# EAGLE design rooftop_reflector_v1.2 (EAGLE 9.6.2)
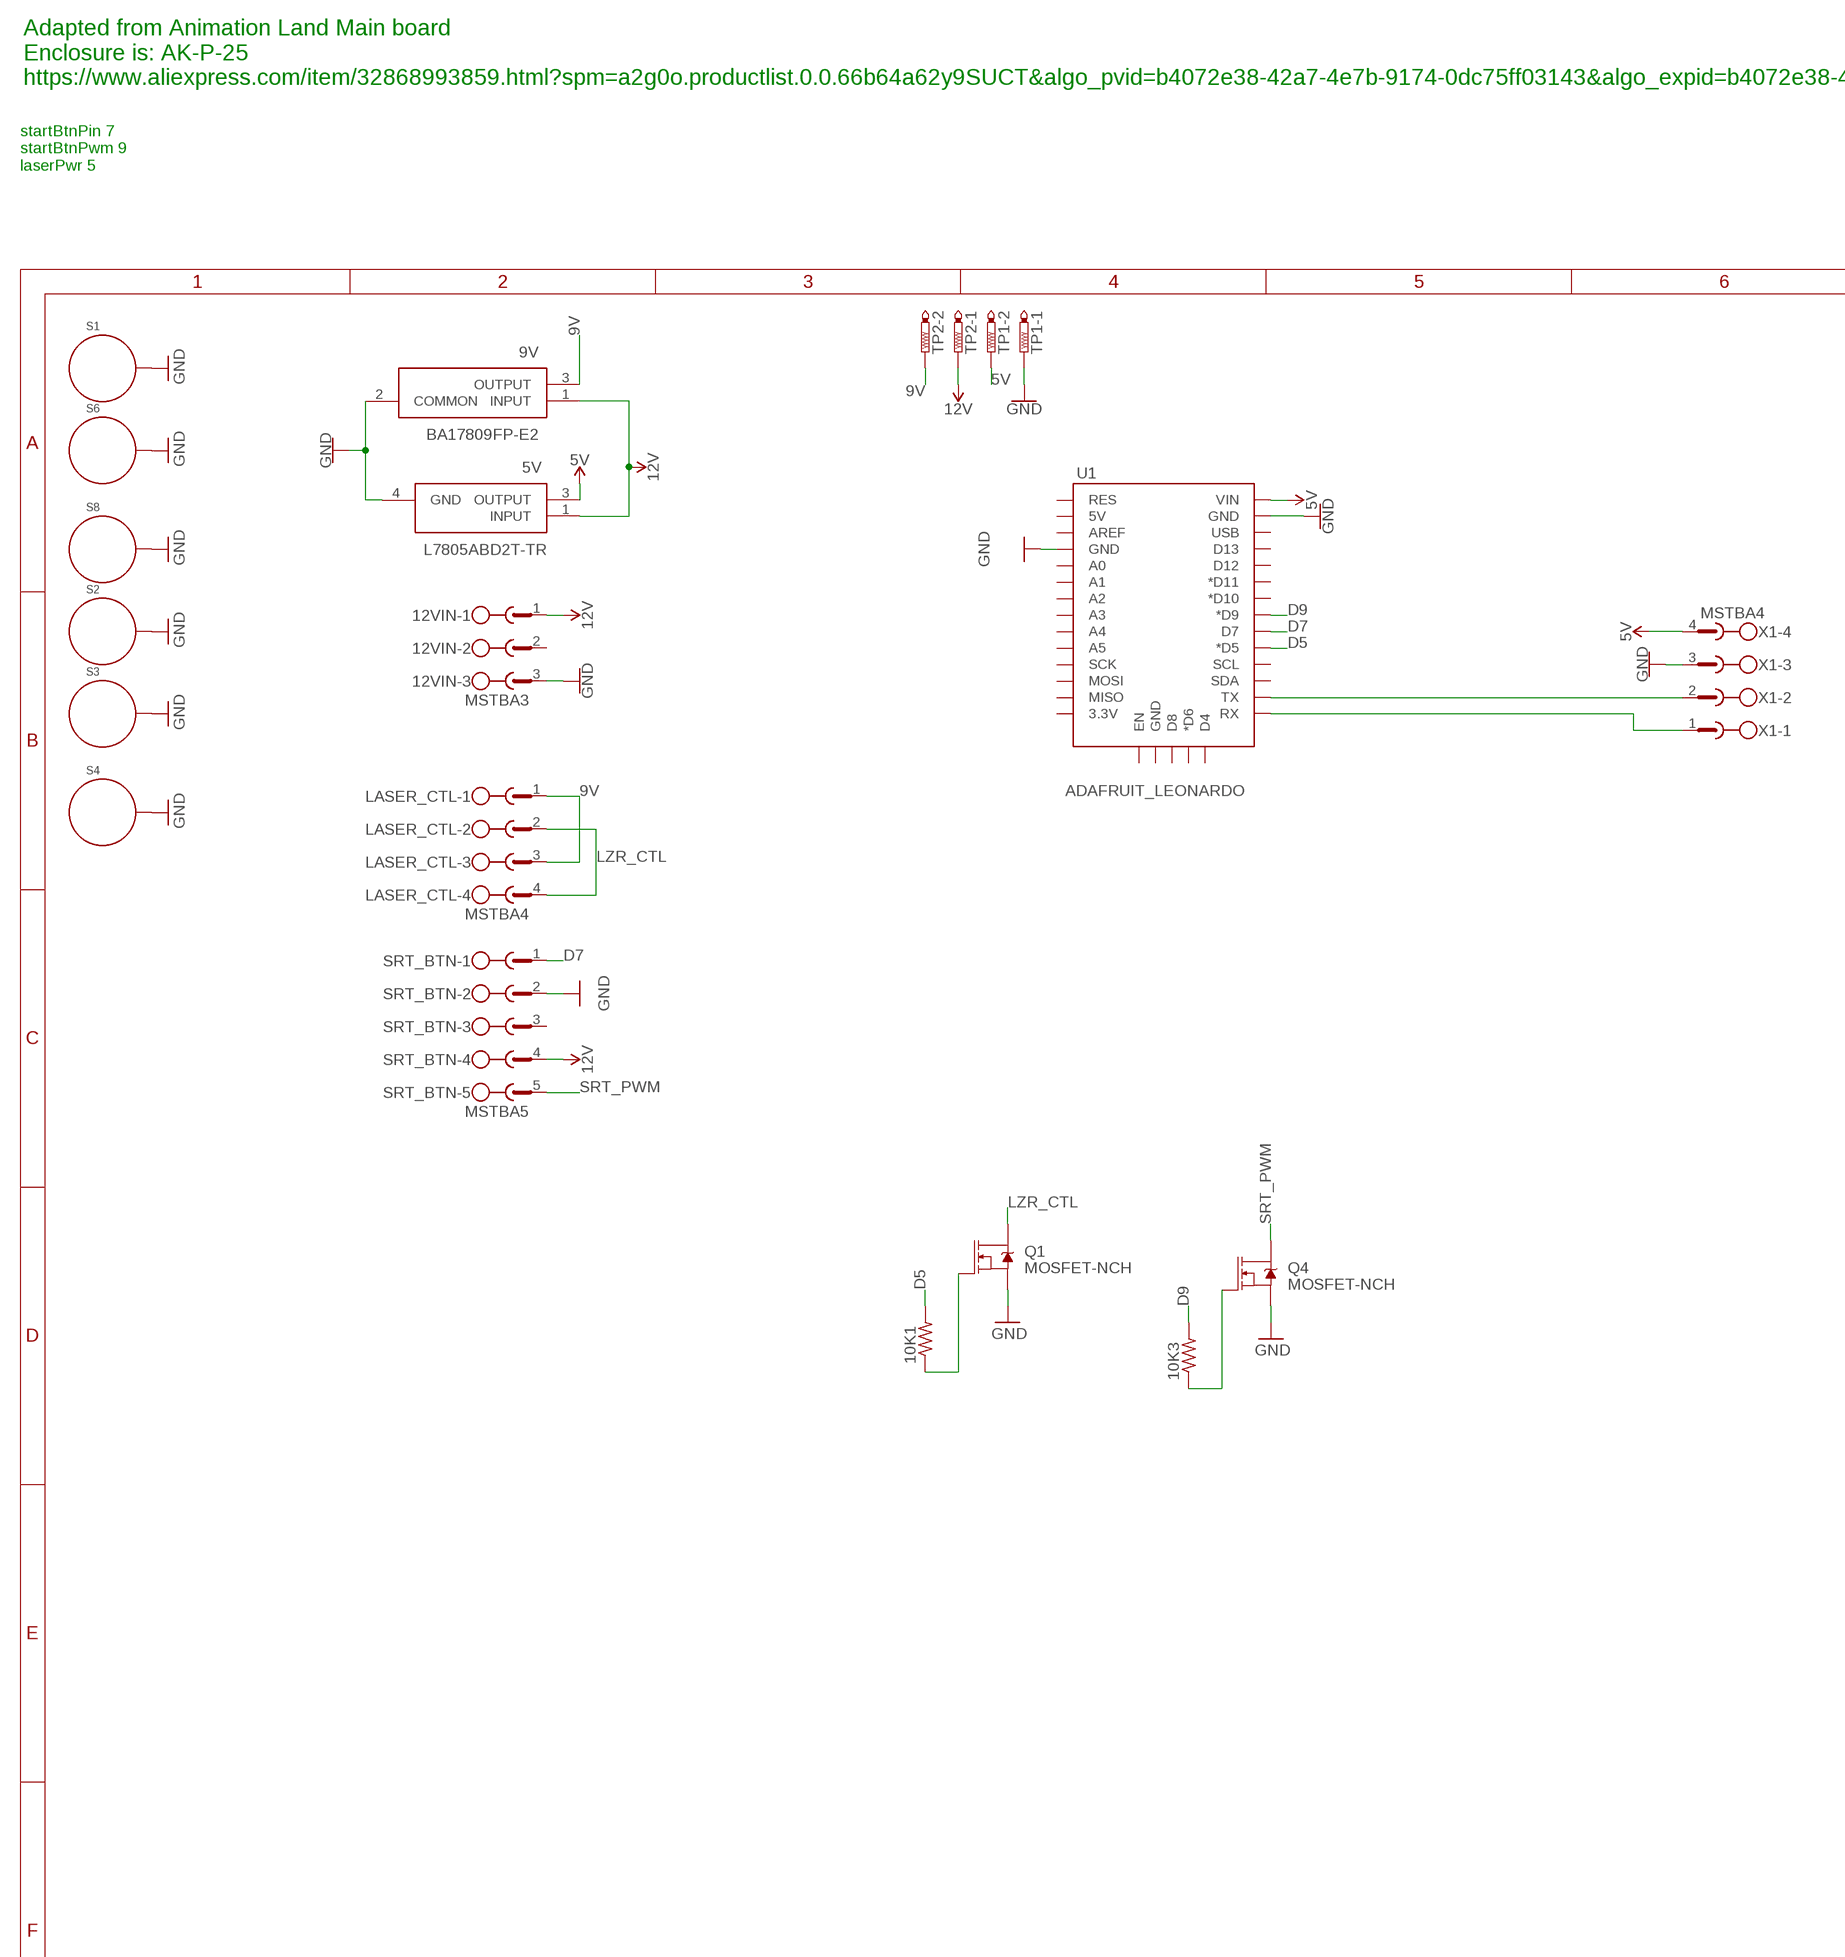
[diagram p0: schematic, sheet 1, part 1 of 2]
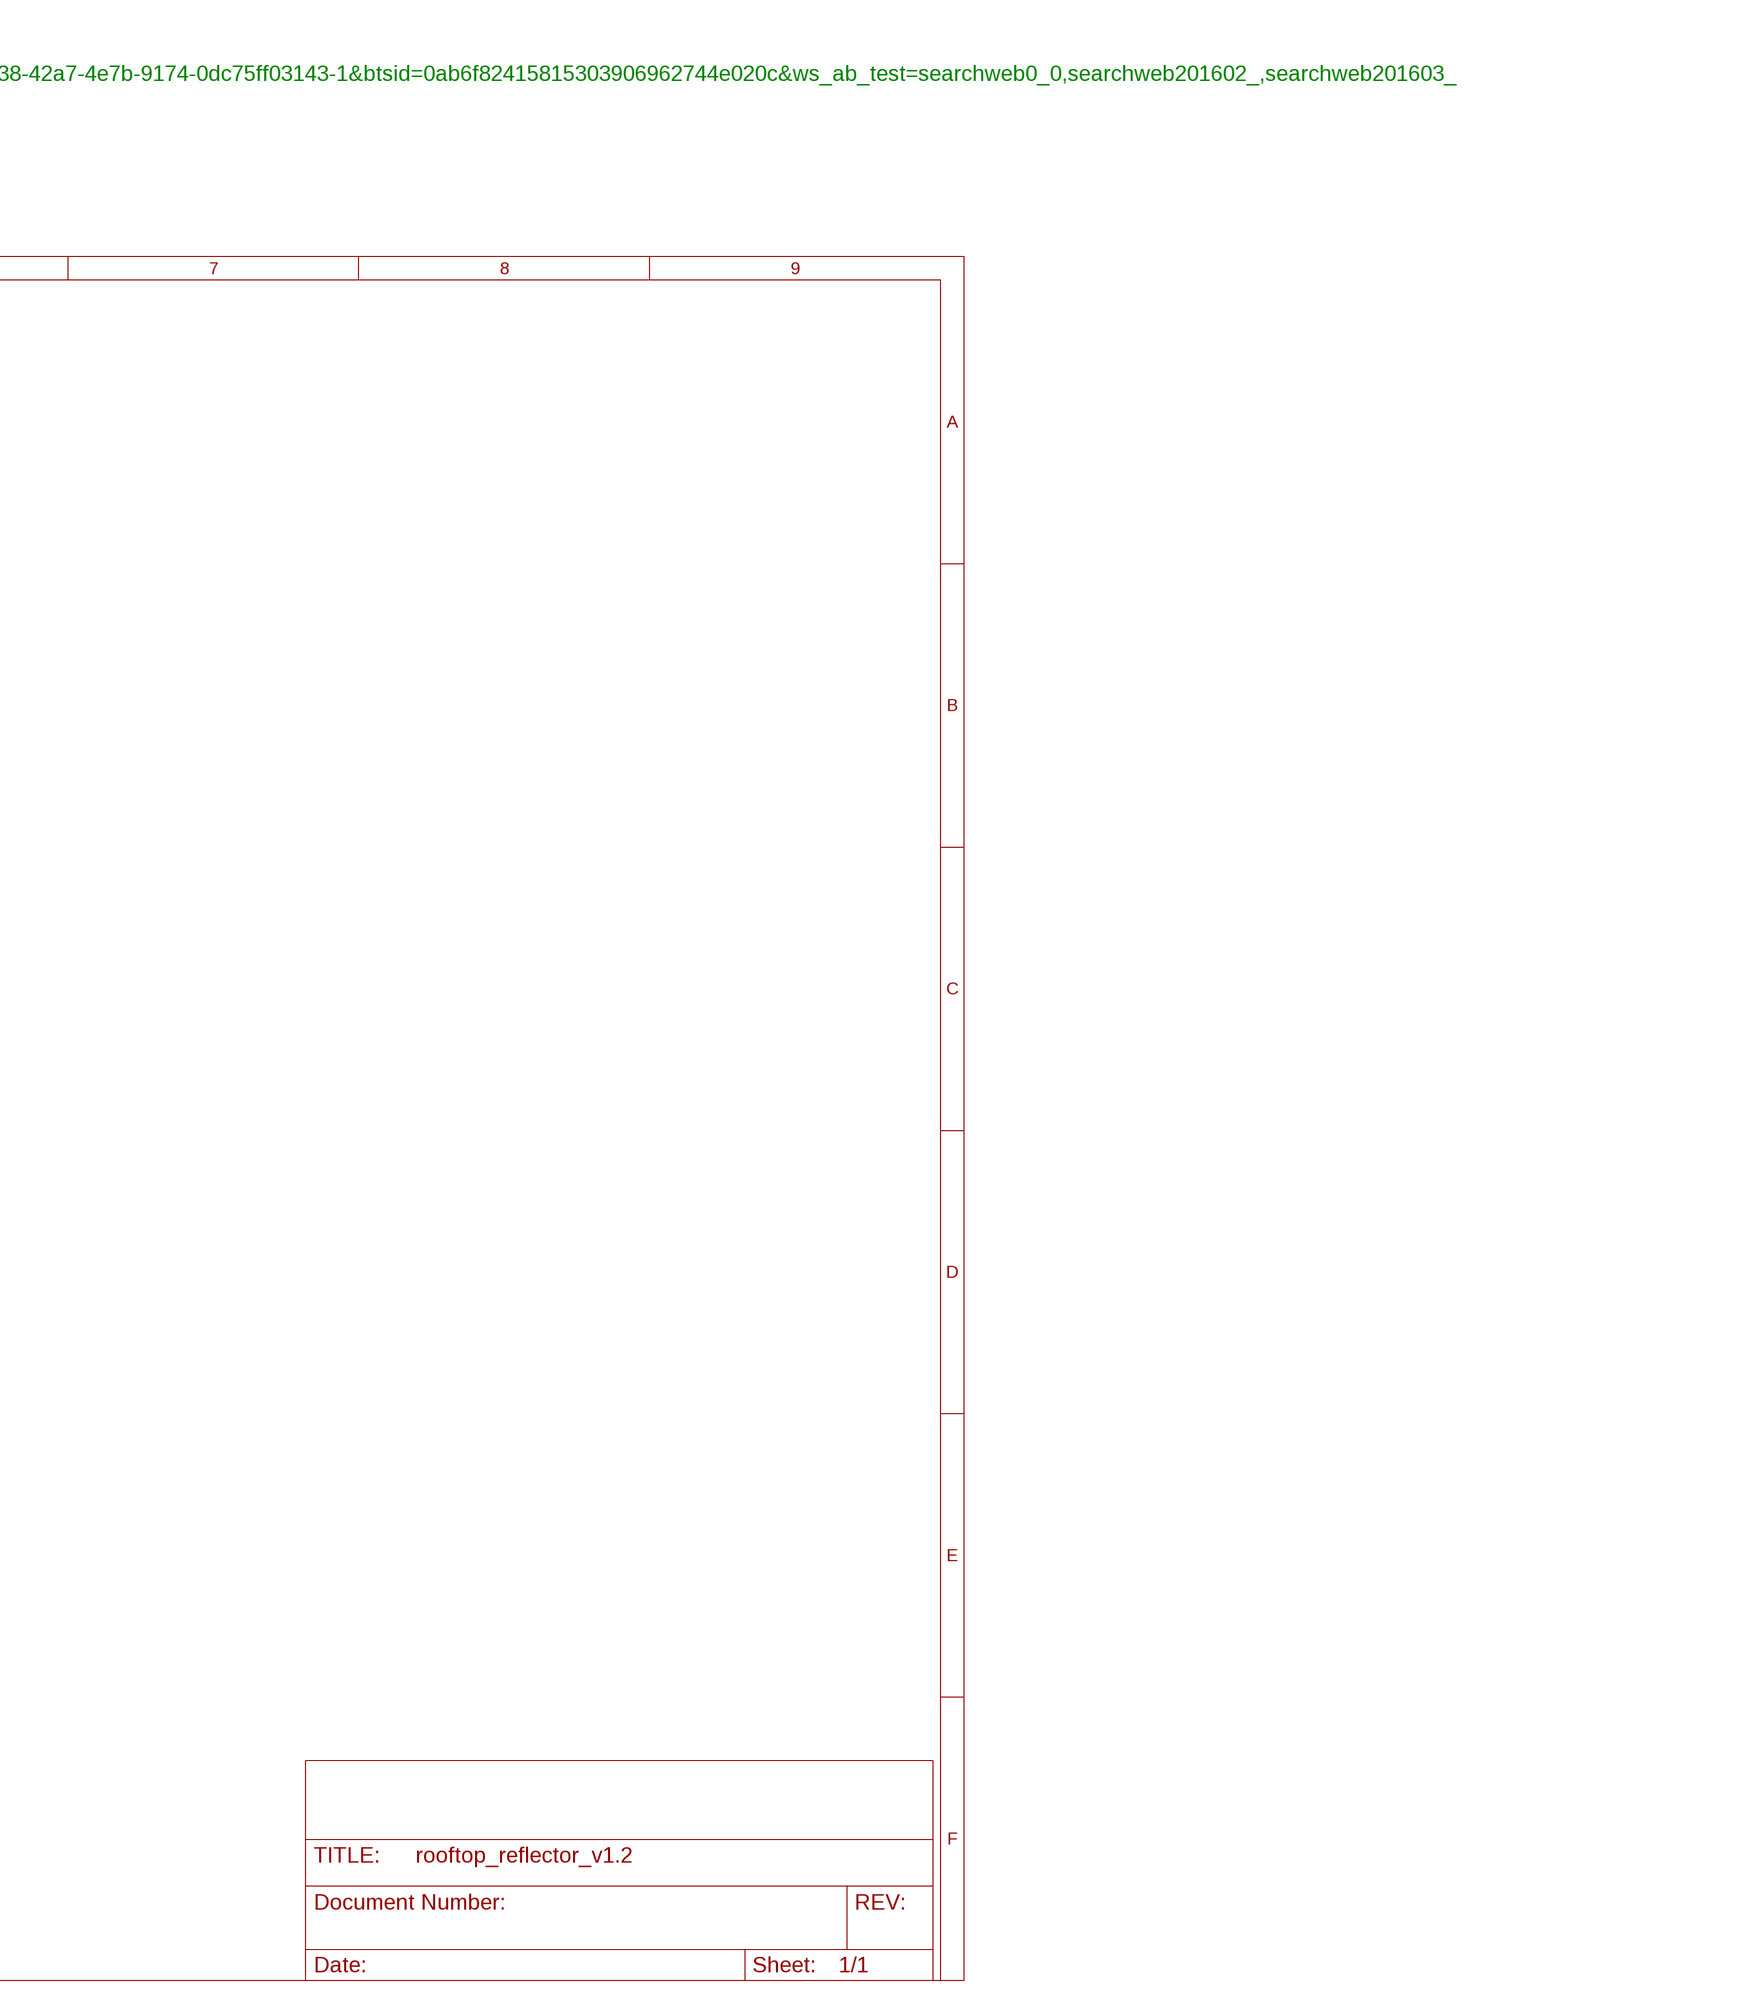
[diagram p1: schematic, sheet 1, part 2 of 2]

## Parts
5V  L7805ABD2T-TR  [D2PAK-STB35NF10T4]
9V  BA17809FP-E2  [BA17809FPE2]
10K1  R-US_M0805  [M0805]
10K3  R-US_M0805  [M0805]
12VIN  MSTBA3  [MSTBA3]
LASER_CTL  MSTBA4  [MSTBA4]
Q1  MOSFET-NCH  [SO-8_POWER_PAK]
Q4  MOSFET-NCH  [SO-8_POWER_PAK]
S1  STANDOFF_ELECTRICAL5-32  [STANDOFF_ELECTRICAL_5_32]
S2  STANDOFF_ELECTRICAL5-32  [STANDOFF_ELECTRICAL_5_32]
S3  STANDOFF_ELECTRICAL5-32  [STANDOFF_ELECTRICAL_5_32]
S4  STANDOFF_ELECTRICAL5-32  [STANDOFF_ELECTRICAL_5_32]
S6  STANDOFF_ELECTRICAL5-32  [STANDOFF_ELECTRICAL_5_32]
S8  STANDOFF_ELECTRICAL5-32  [STANDOFF_ELECTRICAL_5_32]
SRT_BTN  MSTBA5  [MSTBA5]
TP1  PTR2  [P2-38-17]
TP2  PTR2  [P2-38-17]
U1  ADAFRUIT_LEONARDO  [ADAFRUIT_LENOARDO]
X1  MSTBA4  [MSTBA4]

## Nets
5V [High Power]: 5V.3(OUTPUT) TP1.TP-2 U1.VIN X1.4
9V [High Power]: 9V.3(OUTPUT) LASER_CTL.1 LASER_CTL.3 TP2.TP-2
12V [High Power]: 5V.1(INPUT) 9V.1(INPUT) 12VIN.1 SRT_BTN.4 TP2.TP-1
D5: 10K1.2 U1.D5(*D5)
D7 [Low Power]: SRT_BTN.1 U1.D7
D9 [Low Power]: 10K3.2 U1.D9(*D9)
GND [High Power]: 5V.4(GND) 9V.2(COMMON) 12VIN.3 Q1.S Q4.S S1.P1 S2.P1 S3.P1 S4.P1 S6.P1 S8.P1 SRT_BTN.2 TP1.TP-1 U1.GND@0(GND) U1.GND@2(GND) X1.3
LZR_CTL [Low Power]: LASER_CTL.2 LASER_CTL.4 Q1.D1(D)
N$4 [Low Power]: 10K1.1 Q1.G
N$7: U1.TX X1.2
N$8: U1.RX X1.1
N$27 [Low Power]: 10K3.1 Q4.G
SRT_PWM [High Power]: Q4.D1(D) SRT_BTN.5
Unconnected: 12VIN.2 SRT_BTN.3 U1.3V(3.3V) U1.5V U1.A0 U1.A1 U1.A2 U1.A3 U1.A4 U1.A5 U1.AREF U1.D4 U1.D6(*D6) U1.D8 U1.D10(*D10) U1.D11(*D11) U1.D12 U1.D13 U1.EN U1.GND@1(GND) U1.MISO U1.MOSI U1.RES U1.SCK U1.SCL U1.SDA U1.USB

## Notes on the sheet
- Adapted from Animation Land Main board
  Enclosure is: AK-P-25
  https://www.aliexpress.com/item/32868993859.html?spm=a2g0o.productlist.0.0.66b64a62y9SUCT&algo_pvid=b4072e38-42a7-4e7b-9174-0dc75ff03143&algo_expid=b4072e38-42a7-4e7b-9174-0dc75ff03143-1&btsid=0ab6f82415815303906962744e020c&ws_ab_test=searchweb0_0,searchweb201602_,searchweb201603_
- startBtnPin 7
  startBtnPwm 9
  laserPwr 5

## Library data of the parts
5V = SamacSys_Parts:L7805ABD2T-TR: Linear Voltage Regulators 5.0V 1.0A Positive Source: Datasheet <https://www.st.com/resource/en/datasheet/l78.pdf>; DESCRIPTION: Linear Voltage Regulators 5.0V 1.0A Positive; HEIGHT: mm; MANUFACTURER_NAME: STMicroelectronics; MANUFACTURER_PART_NUMBER: L7805ABD2T-TR; MOUSER_PART_NUMBER: 511-L7805ABD2T-TR; MOUSER_PRICE-STOCK: https://www.mouser.co.uk/ProductDetail/STMicroelectronics/L7805ABD2T-TR?qs=LL%252BsqOK9SqOQ%2FfZD5ZsNqA%3D%3D
9V = SamacSys_Parts:BA17809FP-E2: Linear Voltage Regulators REGULATOR 9V Source: Datasheet <https://componentsearchengine.com/Datasheets/2/BA17809FP-E2.pdf>; DESCRIPTION: Linear Voltage Regulators REGULATOR 9V; HEIGHT: 2.5mm; MANUFACTURER_NAME: ROHM Semiconductor; MANUFACTURER_PART_NUMBER: BA17809FP-E2; MOUSER_PART_NUMBER: 755-BA17809FP-E2; MOUSER_PRICE-STOCK: https://www.mouser.co.uk/ProductDetail/ROHM-Semiconductor/BA17809FP-E2?qs=4kLU8WoGk0vE1rCq7n5Kww%3D%3D
10K1 10K3 = adafruit:R-US_: RESISTOR, American symbol
12VIN = con-phoenix-508:MSTBA3: PHOENIX; MF: FARNELL; MPN: 1757255; OC_FARNELL: 3705183; OC_NEWARK: 71C4162
LASER_CTL X1 = con-phoenix-508:MSTBA4: PHOENIX; MF: FARNELL; MPN: 1757268; OC_FARNELL: 3705195; OC_NEWARK: 71C4163
Q1 Q4 = th_ds_libraries:MOSFET-NCH: N-channel MOSFETs from Sparkfun-DiscreteSemi Library
S1-S4 S6 S8 = th_libraries:STANDOFF_ELECTRICAL: A standoff intended to be an electrically connected point. Pad size and stop size allow for a #8 Phillips pan screw head to make a solid connection to the board. Added 144mill drill hole that fits my normal wood screw
SRT_BTN = con-phoenix-508:MSTBA5: PHOENIX; MPN: 1757271; OC_FARNELL: 3705201; OC_NEWARK: 71C4164
TP1 TP2 = testpad:PTR2: TEST PIN
U1 = th_ds_libraries:ADAFRUIT_LEONARDO: Adafruit ItsyBitsy 32u4 - 5V 16MHz https://www.adafruit.com/product/3677

## Net classes
1 High Power: width 0.406 mm, drill 0.483 mm
2 Low Power: width 0.305 mm, drill 0.483 mm

## Board
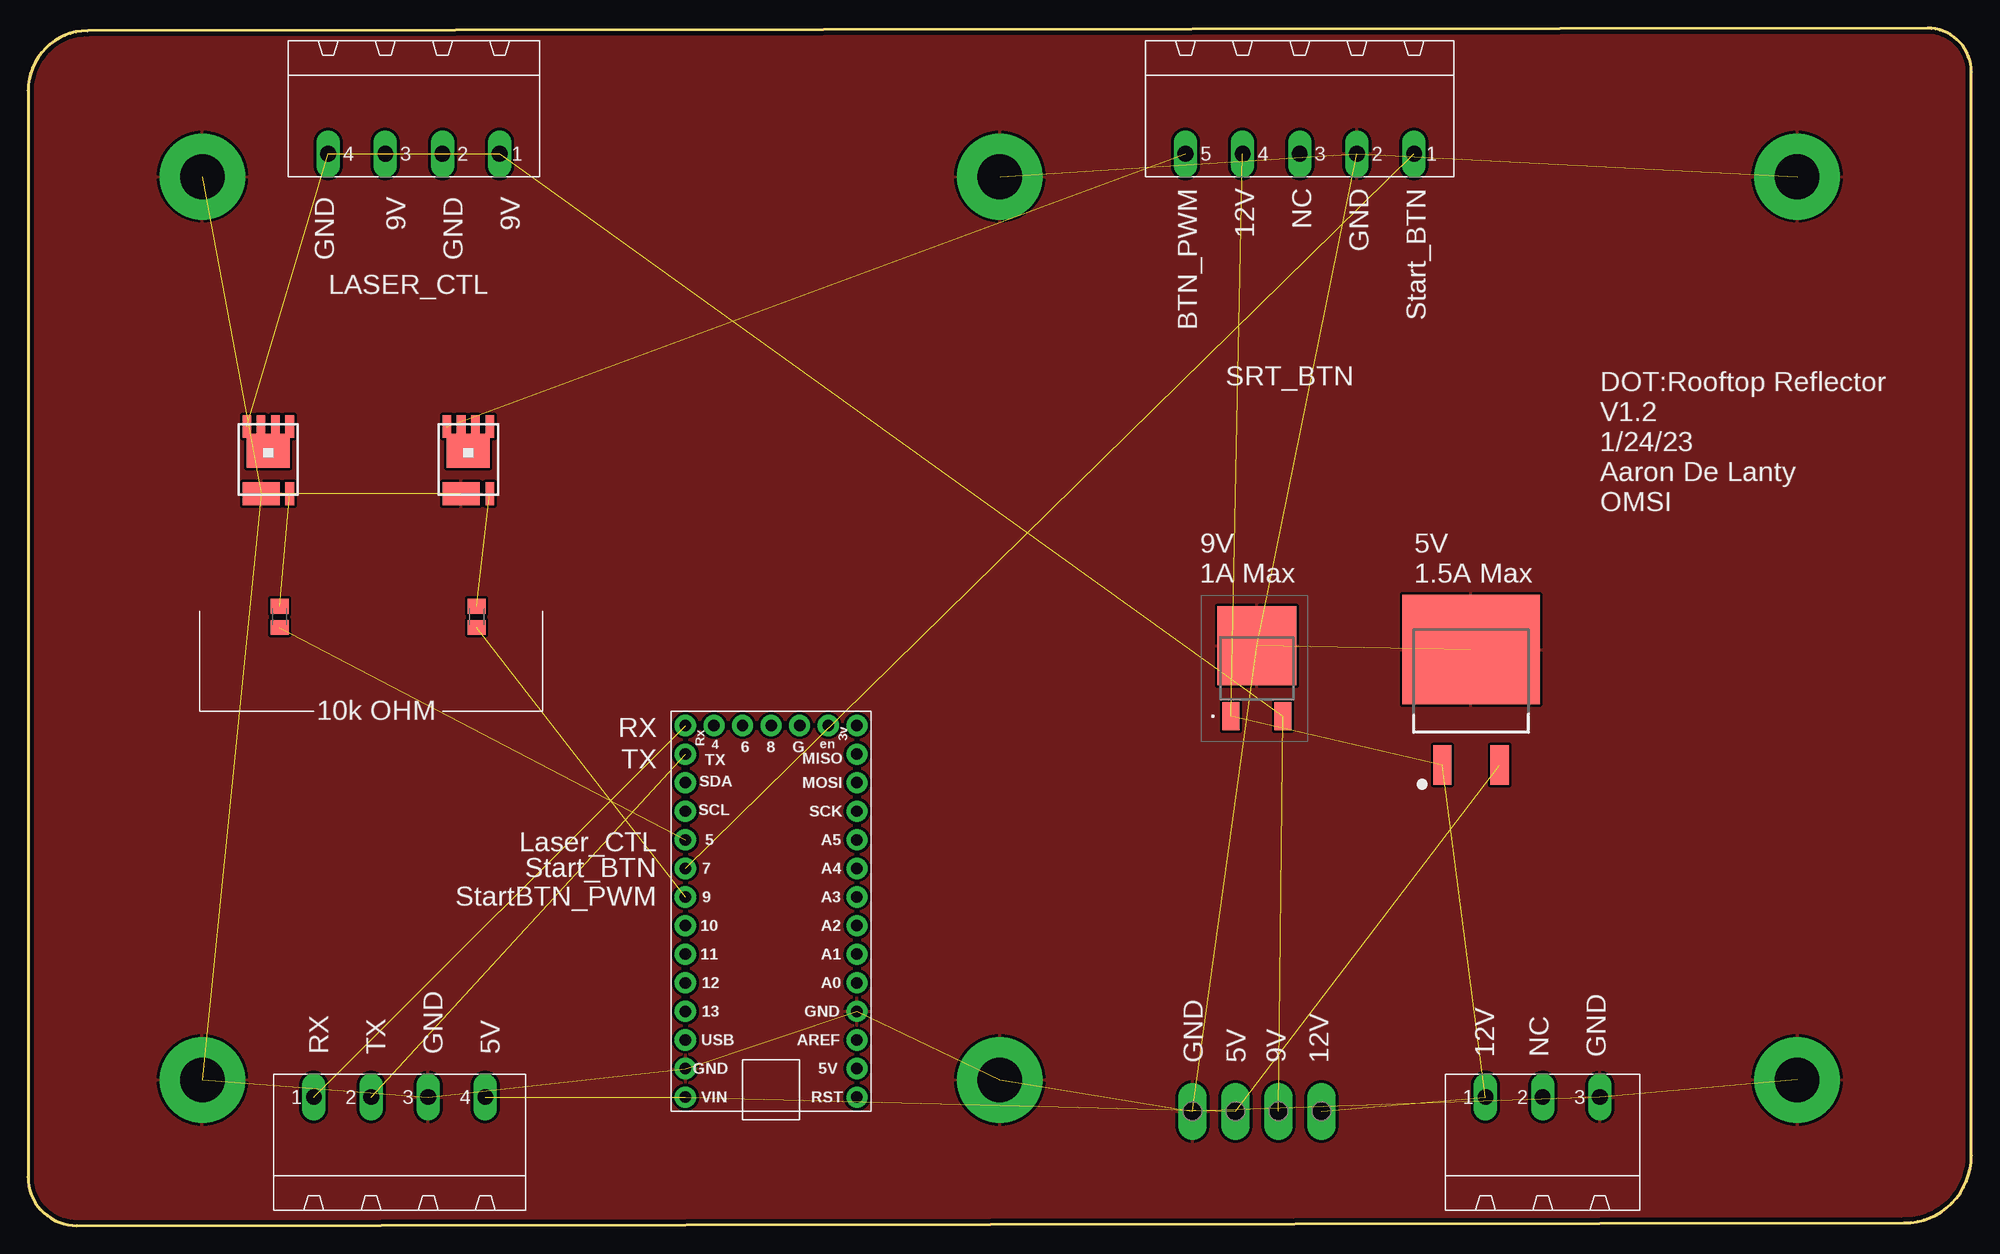
[diagram p2: board, top side]
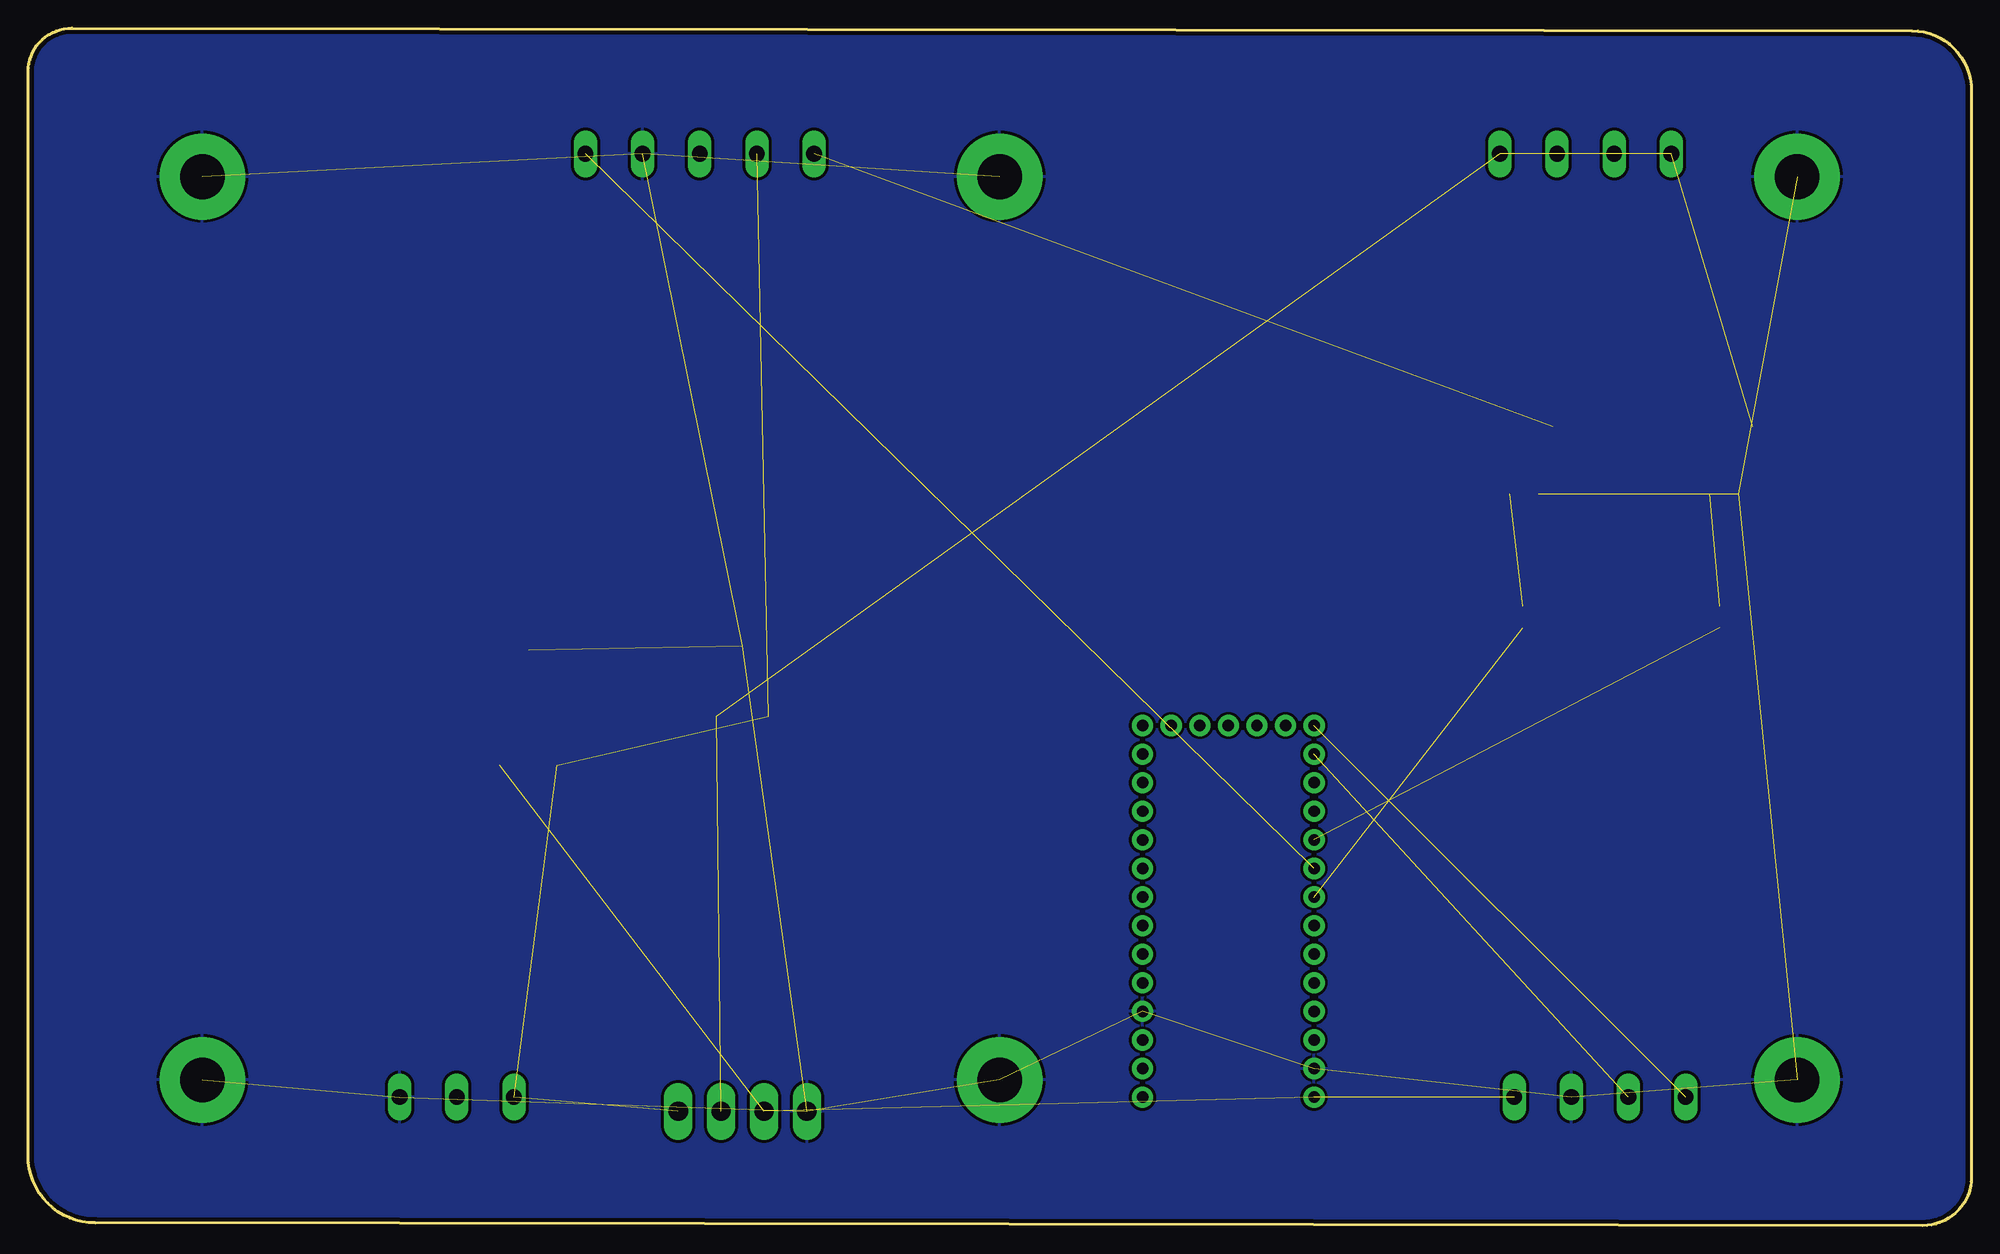
[diagram p3: board, bottom side, seen from below]

Size 172.72 x 106.41 mm. Coordinates in mm from the lower left corner, seen from the top.
Outline: 168.83,106.41 5.28,106.17 arc90 0,100.89 0,4.33 arc90 4.33,0 166.75,0.24 arc90 172.72,6.22 172.72,102.53 arc90 168.83,106.41
Copper layers (1*16): Top 0.035559375mm / dielectric 1.6mm / Bottom 0.035559375mm
Design rules "oshpark-2layer (1) *": minimum track width 10mil, minimum drill 10mil, track to track 8mil, track to pad 8mil, pad to pad 8mil, via to via 8mil, smd to smd 8mil, copper to edge 15mil, drill to drill 6mil, minimum pad ring 5mil, minimum via ring 5mil, stop-mask expansion 2.5mil, vias tented up to drill 25mil, thermal gap 10mil

### Footprints (pad centres in the part's own frame; a part is rotated, then mirrored left to right if it is on the bottom)
D2PAK-STB35NF10T4 = smd 3.5 x 1.6: 1 2.904,-7.64; 3 2.904,-2.56 | smd 9.75 x 12.2: 4 -7.371,-5.1
BA17809FPE2 = smd 1.5 x 2.5: 1 -2.3,-4.25; 3 2.3,-4.25 | smd 7 x 7: 2 0,2
M0805 = smd 1.3 x 1.6: 1 -0.95,0; 2 0.95,0
MSTBA3 = drill 1.397 long: 1 -5.08,5.08; 2 0,5.08; 3 5.08,5.08
MSTBA4 = drill 1.397 long: 1 -7.62,5.08; 2 -2.54,5.08; 3 2.54,5.08; 4 7.62,5.08
SO-8_POWER_PAK = smd 0.762 x 2.032: D1 -3.423,2.437; D2 -2.153,2.437; D3 -0.883,2.437; D4 0.387,2.437; G 0.387,-3.532 | smd 3.81 x 3.048: D5 -1.518,0.278 | smd 3.302 x 2.032: S -2.153,-3.532
STANDOFF_ELECTRICAL_5_32 = drill 3.969 pad 7.62: P1 0,0
MSTBA5 = drill 1.397 long: 1 -10.16,5.08; 2 -5.08,5.08; 3 0,5.08; 4 5.08,5.08; 5 10.16,5.08
P2-38-17 = drill 1.702 pad 2.121 long: TP-1 -1.905,0; TP-2 1.905,0
ADAFRUIT_LENOARDO = drill 1.016 pad 1.88: 3V -10.16,-21.59; 5V -10.16,8.89; A0 -10.16,1.27; A1 -10.16,-1.27; A2 -10.16,-3.81; A3 -10.16,-6.35; A4 -10.16,-8.89; A5 -10.16,-11.43; AREF -10.16,6.35; D4 2.54,-21.59; D5 5.08,-11.43; D6 0,-21.59; D7 5.08,-8.89; D8 -2.54,-21.59; D9 5.08,-6.35; D10 5.08,-3.81; D11 5.08,-1.27; D12 5.08,1.27; D13 5.08,3.81; EN -7.62,-21.59; GND@0 -10.16,3.81; GND@1 -5.08,-21.59; GND@2 5.08,8.89; MISO -10.16,-19.05; MOSI -10.16,-16.51; RES -10.16,11.43; RX 5.08,-21.59; SCK -10.16,-13.97; SCL 5.08,-13.97; SDA 5.08,-16.51; TX 5.08,-19.05; USB 5.08,6.35; VIN 5.08,11.43

### Placement (x,y rotation side)
5V  133.35,43.83 270 top
9V  109.22,49.52 0 top
10K1  22.35,54.1 270 top
10K3  39.88,54.1 270 top
12VIN  134.62,6.34 0 top
LASER_CTL  34.29,100.32 180 top
Q1  22.86,68.57 0 top
Q4  40.64,68.57 0 top
S1  15.49,93.21 0 top
S2  86.36,93.21 0 top
S3  157.23,12.95 0 top
S4  157.23,93.21 0 top
S6  86.36,12.95 0 top
S8  15.49,12.95 0 top
SRT_BTN  113.03,100.32 180 top
TP1  105.41,10.15 0 top
TP2  113.03,10.15 180 top
U1  63.5,22.85 180 top
X1  33.02,6.34 0 top

### Tracks (layer width: path | path; a pad name or v marks a point on that pad's centre or on a via)
5V  (3 unrouted)
9V  (3 unrouted)
12V  (4 unrouted)
D5  (1 unrouted)
D7  (1 unrouted)
D9  (1 unrouted)
GND  (15 unrouted)
  pour Top (isolate 0.254): 0,107.94 173.25,107.94 173.25,1.79 170.18,-1.28 3.59,-1.28 arc-45 1.8,-0.53 0,1.26
  pour Bottom (isolate 0.254): 2.01,107.42 174.52,107.42 174.52,4.33 168.91,-1.28 4.86,-1.28 arc-45 3.07,-0.53 0,2.53 0,104.35 arc-45 0.74,106.15
LZR_CTL  (2 unrouted)
N$4  (1 unrouted)
N$7  (1 unrouted)
N$8  (1 unrouted)
N$27  (1 unrouted)
SRT_PWM  (1 unrouted)

### Text on the board
tPlace: 10k OHM
tNames: GND | 9V | GND | 9V | BTN_PWM | 12V | NC | GND | Start_BTN | DOT:Rooftop Reflector / V1.2 / 1/24/23 / Aaron De Lanty / OMSI | 9V / 1A Max | 5V / 1.5A Max | RX | TX | Laser_CTL | Start_BTN | StartBTN_PWM | RX | TX | GND | 5V | GND | 5V | 9V | 12V | 12V | NC | GND